# Altium schematic sheet MCU.SchDoc
size A4; SheetNumber: 3; SheetTotal: 8
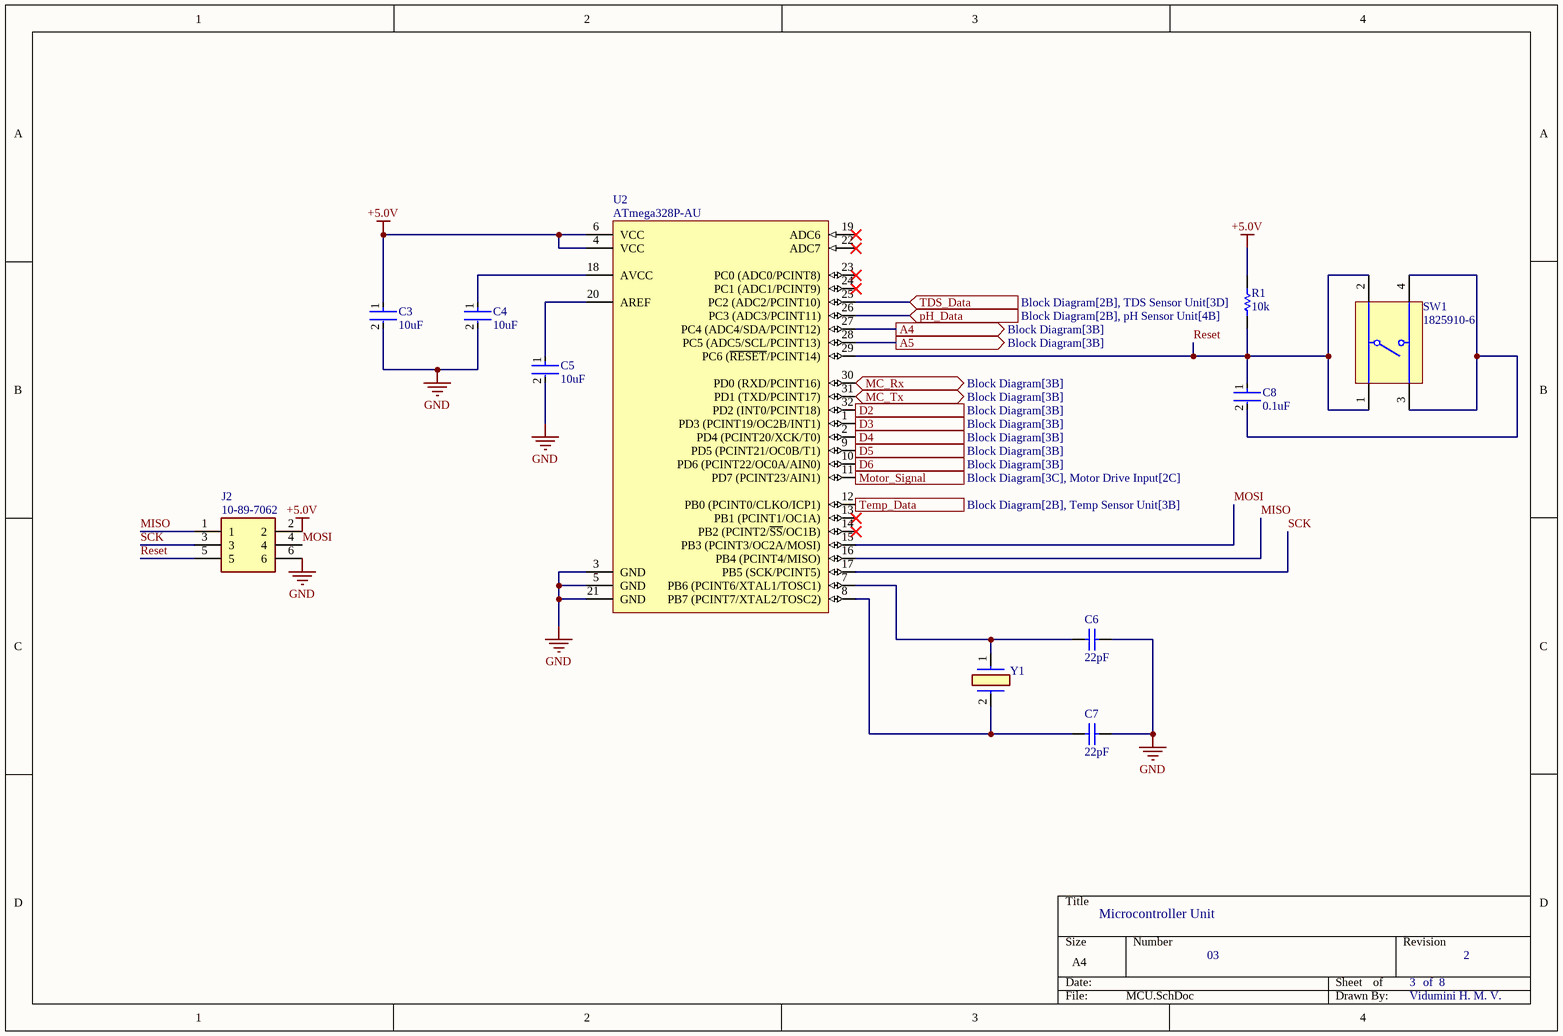
[diagram p0: MCU.SchDoc]

## Parts
C3  10uF  [FP-1206-L_3_2_0_2-W_1_6_0-IPC_B]
C4  10uF  [FP-1206-L_3_2_0_2-W_1_6_0-IPC_B]
C5  10uF  [FP-1206-L_3_2_0_2-W_1_6_0-IPC_B]
C6  22pF  [CAPC2013X115X51NL20T26]
C7  22pF  [CAPC2013X115X51NL20T26]
C8  0.1uF  [FP-1206-L_3_2_0_2-W_1_6_0-IPC_B]
J2  10-89-7062  [HDRV6W87P254_2X3_775X508X864P]
R1  10k  [RESC3116X65X40ML10T20]
SW1  1825910-6  [TECO-1825910-6_V]
U2  ATmega328P-AU  [32A_M]
Y1  ECS-160-20-3X-TR  [ECS160203XTR]  (value not drawn)

## Ports
A4 (out, see Block Diagram[3B]), A5 (out, see Block Diagram[3B]), D2 (out, see Block Diagram[3B]), D3 (out, see Block Diagram[3B]), D4 (out, see Block Diagram[3B]), D5 (out, see Block Diagram[3B]), D6 (out, see Block Diagram[3B]), MC_Rx (bidir, see Block Diagram[3B]), MC_Tx (bidir, see Block Diagram[3B]), Motor_Signal (out, see Block Diagram[3C], Motor Drive Input[2C]), pH_Data (in, see Block Diagram[2B], pH Sensor Unit[4B]), TDS_Data (in, see Block Diagram[2B], TDS Sensor Unit[3D]), Temp_Data (in, see Block Diagram[2B], Temp Sensor Unit[3B])

## Nets
+5.0V: C3.1 J2.2 R1.2 U2.4(VCC) U2.6(VCC)
GND: C3.2 C4.2 C5.2 C6.2 C7.2 J2.6 U2.3(GND) U2.5(GND) U2.21(GND)
A4: U2.27(PC4_(ADC4/SDA/PCINT12)) ; port A4
A5: U2.28(PC5_(ADC5/SCL/PCINT13)) ; port A5
D2: U2.32(PD2_(INT0/PCINT18)) ; port D2
D3: U2.1(PD3_(PCINT19/OC2B/INT1)) ; port D3
D4: U2.2(PD4_(PCINT20/XCK/T0)) ; port D4
D5: U2.9(PD5_(PCINT21/OC0B/T1)) ; port D5
D6: U2.10(PD6_(PCINT22/OC0A/AIN0)) ; port D6
MC_Rx: U2.30(PD0_(RXD/PCINT16)) ; port MC_Rx
MC_Tx: U2.31(PD1_(TXD/PCINT17)) ; port MC_Tx
MISO: J2.1 U2.16(PB4_(PCINT4/MISO))
MOSI: J2.4 U2.15(PB3_(PCINT3/OC2A/MOSI))
Motor_Signal: U2.11(PD7_(PCINT23/AIN1)) ; port Motor_Signal
pH_Data: U2.26(PC3_(ADC3/PCINT11)) ; port pH_Data
Reset: C8.1 J2.5 R1.1 SW1.1 SW1.2 U2.29(PC6_(~{RESET}/PCINT14))
SCK: J2.3 U2.17(PB5_(SCK/PCINT5))
TDS_Data: U2.25(PC2_(ADC2/PCINT10)) ; port TDS_Data
Temp_Data: U2.12(PB0_(PCINT0/CLKO/ICP1)) ; port Temp_Data
NetC4_1: C4.1 U2.18(AVCC)
NetC5_1: C5.1 U2.20(AREF)
NetC6_1: C6.1 U2.7(PB6_(PCINT6/XTAL1/TOSC1)) Y1.1(X1)
NetC7_1: C7.1 U2.8(PB7_(PCINT7/XTAL2/TOSC2)) Y1.2(X2)
NetC8_2: C8.2 SW1.3 SW1.4

Not connected (* = marked no-connect by the designer): U2 13(PB1_(PCINT1/OC1A))* 14(PB2_(PCINT2/~{SS}/OC1B))* 19(ADC6)* 22(ADC7)* 23(PC0_(ADC0/PCINT8))* 24(PC1_(ADC1/PCINT9))*

## Notes on the sheet
- Microcontroller Unit
- 03
- 3
- of  8
- 2
- Vidumini H. M. V.

## Library data of the parts
C3-C5 = CMP-04427-000082-1: General Purpose Ceramic Capacitor, 1206, 10uF, 10%, X5R, 15%, 16V; Max Operating Temperature: 85°C; Tolerance: 10%; Dielectric: X5R; Series: -; Case Code (Imperial): 1206; Width: 1.6mm; Termination: SMD/SMT; Voltage Rating: 16V; REACH SVHC: No SVHC; Length: 3.2mm; Size: 1.78mm; Capacitance: 10uF; Package Quantity: 1; Voltage: 16V; RoHS Compliant: Yes; Thickness: 0.07inch; Mount: Surface Mount; Radiation Hardening: No; Voltage Rating (DC): 16V; Min Operating Temperature: -55°C; Case Code (Metric): 3216; Construction: Flat; Depth: 1.6mm; Height: 0.07mm; Lead Free: Lead Free; Number of Pins: 2; Case/Package: 1206; Packaging: Tape and Reel
C6 C7 = CMP-2007-04866-1: Manufacturer: AVX Interconnect / Elco; Part Number: 08052U220GAT2A
C8 = CMP-1037-04173-2: General Purpose Ceramic Capacitor, 1206, 100nF, 10%, X7R, 15%, 10V; Max Operating Temperature: 125°C; Case Code (Imperial): 1206; Voltage Rating: 10V; Voltage Rating (DC): 10V; Height: 0.94mm; Depth: 1.6mm; Tolerance: 10%; Dielectric: X7R; Case Code (Metric): 3216; Case/Package: 1206; Series: -; REACH SVHC: No SVHC; Dielectric Material: Ceramic; Mount: Surface Mount; RoHS Compliant: Yes; Length: 3.2mm; Thickness: 0.037inch; Package Quantity: 4000; Construction: Flat; Width: 1.6mm; Packaging: Tape and Reel; Min Operating Temperature: -55°C; Termination: SMD/SMT; Number of Pins: 2; Capacitance: 100nF
J2 = 10-89-7062: Connector; Manufacturer_Name: Molex; Datasheet Link: https://componentsearchengine.com/Datasheets/1/10-89-7062.pdf; Height: 8.64mm; Manufacturer_Part_Number: 10-89-7062; Mouser Part Number: 538-10-89-7062; Mouser Price/Stock: https://www.mouser.co.uk/ProductDetail/Molex/10-89-7062?qs=tRPrwvvr%2Fuh8n6rY9aRt4Q%3D%3D
R1 = CMP-1014-00623-2: Chip Resistor, 10 KOhm, +/- 1%, 0.25 W, -55 to 155 degC, 1206 (3216 Metric), RoHS, Tape and Reel; Manufacturer: Yageo; Voltage Rating: 200V; Resistance: 10KOhm; Temperature Coefficient: 100ppm/degreesC; Power Rating: 250mW; Packaging: TapeandReel; Termination: SMD/SMT; REACH SVHC: Unknown; Tolerance: 1%; Height: 0.55mm; Composition: ThickFilm; Max Operating Temperature: 155degC; Datasheet Version: Rev. 5, 10/2016; Lead Free: LeadFree; Case Code (Metric): 3216; Depth: 1.6mm; Package Quantity: 5000; RoHSCompliant: true; Military Standard: Not; Case/Package: 1206; Case Code (Imperial): 1206; Min Operating Temperature: -55degC; Datasheet URL: http://www.yageo.com/NewPortal/yageodocoutput?fileName=/pdf/R-Chip/PYu-RC_Group_51_RoHS_L_5.pdf; Length: 3.1mm; Manufacturer URL: http://www.yageo.com/; Package Reference: 1206.0; Width: 1.6mm; Package Description: 2-Pin Surface Mount Device, Body 3.1 x 1.6 mm
SW1 = CMP-1684-00021-1: Tact Switch, SPST-NO, 0.05 A, -35 to 85 degC, 4-Pin THD, RoHS, Bulk; Manufacturer: TE Connectivity; Maximum Contact Resistance: 100mOhm; Mechanical Life: 100000Cycles; Bushing Type: Unthreaded; Switch Configuration: OFF(ON); Maximum DC Voltage Rating: 24V; Contact Rating @ Voltage: 0.05A@24VDC; Actuator Color: Black; Body Orientation: Straight; Function: MomentaryContact; Illumination: N/R; Actuator Style: RoundButton; Actuator Material: PolybutyleneTerephthalate; Dielectric Strength: 500VAC; Pole Throw Configuration: SPST; Actuator Length: 1.4mm; Product Weight: N/A; Contact Material: CopperAlloy; Housing Material: N/A; Terminal Type: PCPins; Minimum Insulation Resistance: 100MOhm; Package Description: 4-Pin Through Hole Device, Body 5.99 x 5.99 mm, Pitch 6.5 mm; Part No: 1825910-6; Package Reference: THD; Base Material: N/A; Manufacturer URL: http://www.te.com; Contact Plating: Silver; RoHS: Yes; Datasheet Version: Rev. C9; Electrical Life: 100000Cycles; Maximum AC Voltage Rating: N/A; Thread Size: N/R; Operating Temperature: -35to85C; Mounting: ThroughHole; Dimension: 5.99x5mm; Datasheet URL: http://www.te.com/commerce/DocumentDelivery/DDEController?Action=showdoc&DocId=Customer+Drawing%7F1825910%7FC9%7Fpdf%7FEnglish%7FENG_CD_1825910_C9.pdf%7F1825910-6; Family: 1825910; Seal Location: N/A; Seal Description: N/A; Packaging: N/A
U2 = CMP-0095-00269-2: 8-bit AVR Microcontroller, 32KB Flash, 1KB EEPROM, 2KB SRAM, 32-pin TQFP, Industrial Grade (-40°C to 85°C); PackageDescription: 32-Lead, 7x7x1.0 mm Body, 0.8mm Lead Pitch, Thin Profile Plastic Quad Flat Package (TQFP); DatasheetVersion: revD, May-2011; RevisionNote: DatasheetVersion & PackageVersion updated. URLs added.; ComponentLink1URL: http://www.atmel.com/; ComponentLink2Description: ATmega48A/48PA/88A/88PA/168A/168PA/328/328P Datasheet; Code_JEDEC: MS-026-ABA; ComponentLink1Description: Manufacturer URL; PackageReference: 32A; ComponentLink3Description: ATmega48A/48PA/88A/88PA/168A/168PA/328/328P Summary; ComponentLink2URL: http://www.atmel.com/dyn/resources/prod_documents/doc8271.pdf; PackageVersion: revC, Oct-2010; ComponentLink3URL: http://www.atmel.com/dyn/resources/prod_documents/8271S.pdf
Y1 = ECS-160-20-3X-TR: Crystal or Oscillator; Manufacturer_Name: ECS; Datasheet Link: https://www.arrow.com/en/products/ecs-160-20-3x-tr/ecs-international; Height: 2.3mm; Manufacturer_Part_Number: ECS-160-20-3X-TR; Mouser Part Number: 520-160-20-3XT; Mouser Price/Stock: https://www.mouser.co.uk/ProductDetail/ECS/ECS-160-20-3X-TR?qs=7Z%2FjUg96RbU1ElbRFXn8Rw%3D%3D; Arrow Part Number: ECS-160-20-3X-TR; Arrow Price/Stock: https://www.arrow.com/en/products/ecs-160-20-3x-tr/ecs-international?region=nac